# Altium schematic sheet CH32V307WCU6-R0.SchDoc
size 332 x 281 mm
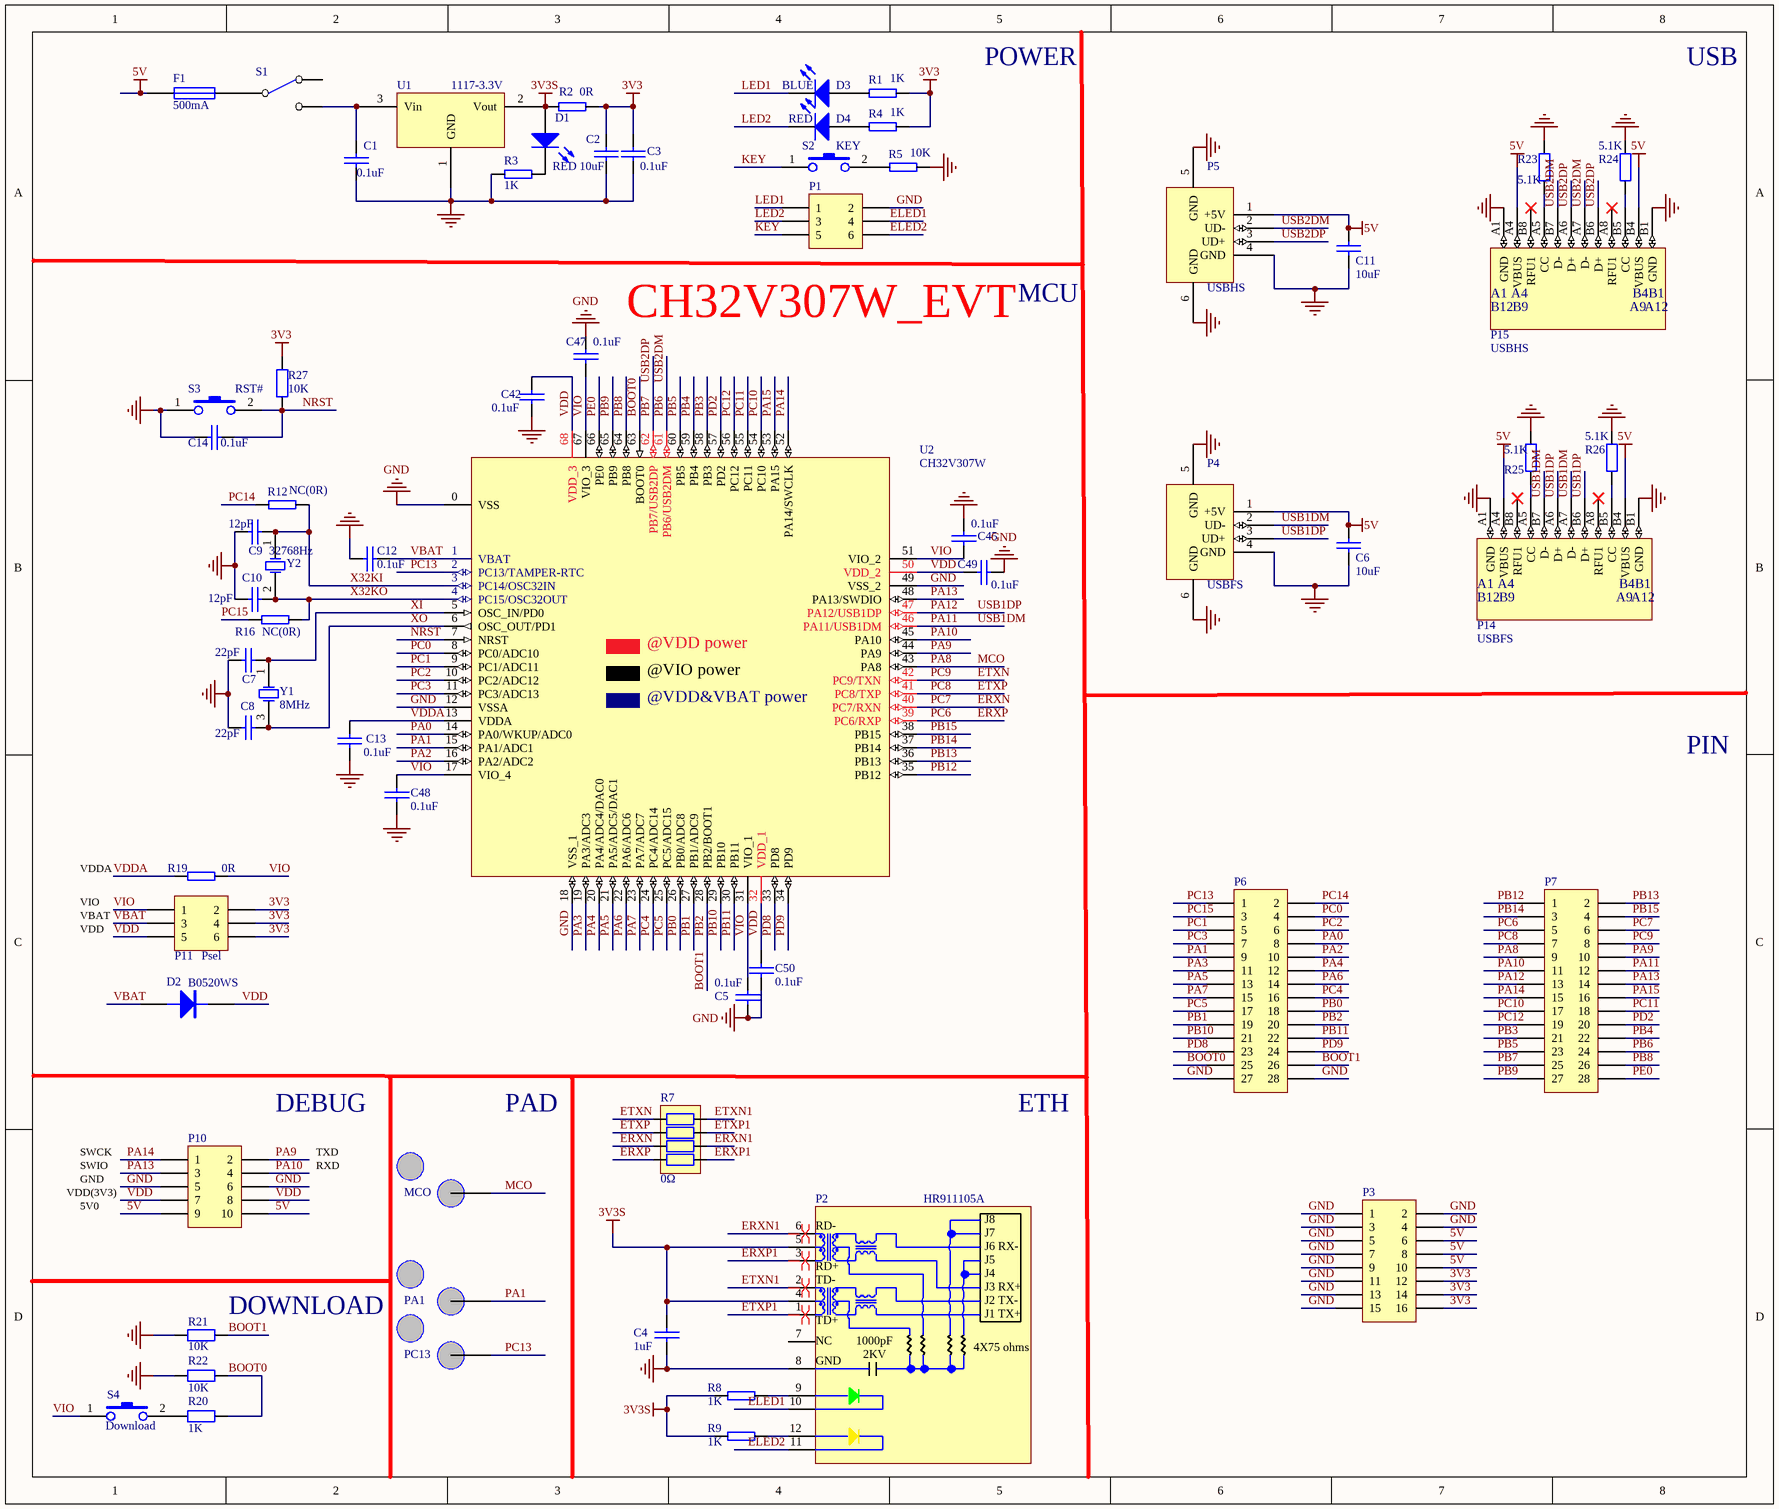
[diagram p0: CH32V307WCU6-R0.SchDoc]

## Parts
C1  0.1uF  [0603_C]
C2  10uF  [3216_C]
C3  0.1uF  [0603_C]
C4  1uF  [0603_C]
C5  0.1uF  [0603_C]
C6  10uF  [3216_C]
C7  22pF  [0603_C]
C8  22pF  [0603_C]
C9  12pF  [0603_C]
C10  12pF  [0603_C]
C11  10uF  [3216_C]
C12  0.1uF  [0603_C]
C13  0.1uF  [0603_C]
C14  0.1uF  [0603_C]
C42  0.1uF  [0603_C]
C45  0.1uF  [0603_C]
C47  0.1uF  [0603_C]
C48  0.1uF  [0603_C]
C49  0.1uF  [0603_C]
C50  0.1uF  [0603_C]
D1  RED  [0603+]
D2  B0520WS  [SOD-323]
D3  BLUE  [0603+]
D4  RED  [0603+]
F1  500mA  [0603]
MCO  Testpoint  [TESTPOINT1]  (value not drawn)
P1  IO  [IDC6-2.54mm]  (value not drawn)
P2  HR911105A  [HR911105A]
P3  Ppin  [IDC16-2.54mm]  (value not drawn)
P4  USBFS  [USBAF]
P5  USBHS  [USBAF]
P6  HEADER 14x2  [IDC28-2.54MM]  (value not drawn)
P7  HEADER 14x2  [IDC28-2.54MM]  (value not drawn)
P10  LINK  [IDC10-2.54mm]  (value not drawn)
P11  Psel  [IDC6-2.54mm]
P14  USBFS  [TYPE-C-Receptacle-2.0]
P15  USBHS  [TYPE-C-Receptacle-2.0]
PA1  Testpoint  [TESTPOINT1]  (value not drawn)
PC13  Testpoint  [TESTPOINT1]  (value not drawn)
R1  1K  [0603]
R2  0R  [0603]
R3  1K  [0603]
R4  1K  [0603]
R5  10K  [0603]
R7  0Ω  [8P4R-0603]
R8  1K  [0603]
R9  1K  [0603]
R12  NC(0R)  [0603]
R16  NC(0R)  [0603]
R19  0R  [0603]
R20  1K  [0603]
R21  10K  [0603]
R22  10K  [0603]
R23  5.1K  [0603]
R24  5.1K  [0603]
R25  5.1K  [0603]
R26  5.1K  [0603]
R27  10K  [0603]
S1  SW SPDT  [KEY2]  (value not drawn)
S2  KEY  [SMD_6.1x3.65x2.5mm-KEY]
S3  RST#  [SMD_6.1x3.65x2.5mm-KEY]
S4  Download  [SMD_6.1x3.65x2.5mm-KEY]
U1  1117-3.3V  [SOT-223]
U2  CH32V307W  [QFN68_8x8]
Y1  8MHz  [XT3225]
Y2  32768Hz  [FC-135]

## Nets
3V3: C2.1 C3.1 P3.12 P3.14 P3.16 P11.2 P11.4 P11.6 R1.1 R2.1 R4.1 R27.2
3V3S: C4.2 D1.1(A) P2.4 P2.5 R2.2 R8.1 R9.1 U1.2(Vout)
5V: C6.1 C11.1 F1.1 P3.6 P3.8 P3.10 P4.1(+5V) P5.1(+5V) P10.9 P10.10 P14.A4(VBUS) P14.B4(VBUS) P15.A4(VBUS) P15.B4(VBUS)
GND: C1.2 C2.2 C3.2 C4.1 C5.1 C6.2 C7.1 C8.1 C9.1 C10.1 C11.2 C12.1 C13.2 C14.1 C42.1 C45.2 C47.2 C48.2 C49.1 C50.2 P1.2 P2.8 P3.1 P3.2 P3.3 P3.4 P3.5 P3.7 P3.9 P3.11 P3.13 P3.15 P4.4(GND) P4.5(GND) P4.6(GND) P5.4(GND) P5.5(GND) P5.6(GND) P6.27 P6.28 P10.5 P10.6 P14.A1(GND) P14.B1(GND) P15.A1(GND) P15.B1(GND) R3.2 R5.1 R21.2 R22.2 R23.2 R24.2 R25.2 R26.2 S3.1 U1.1(GND) U2.0(VSS) U2.12(VSSA) U2.18(VSS_1) U2.49(VSS_2)
BOOT0: P6.25 R20.1 R22.1 U2.63(BOOT0)
BOOT1: P6.20 P6.26 R21.1 U2.28(PB2/BOOT1)  [also labelled PB2]
ELED1: P1.4 P2.10
ELED2: P1.6 P2.11
ERXN: P7.6 R7.3 U2.40(PC7/RXN)  [also labelled PC7]
ERXN1: P2.6 R7.6
ERXP: P7.5 R7.4 U2.39(PC6/RXP)  [also labelled PC6]
ERXP1: P2.3 R7.5
ETXN: P7.8 R7.1 U2.42(PC9/TXN)  [also labelled PC9]
ETXN1: P2.2 R7.8
ETXP: P7.7 R7.2 U2.41(PC8/TXP)  [also labelled PC8]
ETXP1: P2.1 R7.7
KEY: P1.5 S2.1
LED1: D3.2(K) P1.1
LED2: D4.2(K) P1.3
MCO: MCO.1(point) P7.9 U2.43(PA8)  [also labelled PA8]
NRST: C14.2 R27.1 S3.2 U2.7(NRST)
PA0: P6.8 U2.14(PA0/WKUP/ADC0)
PA1: P6.9 PA1.1(point) U2.15(PA1/ADC1)
PA2: P6.10 U2.16(PA2/ADC2)
PA3: P6.11 U2.19(PA3/ADC3)
PA4: P6.12 U2.20(PA4/ADC4/DAC0)
PA5: P6.13 U2.21(PA5/ADC5/DAC1)
PA6: P6.14 U2.22(PA6/ADC6)
PA7: P6.15 U2.23(PA7/ADC7)
PA9: P7.10 P10.2 U2.44(PA9)
PA10: P7.11 P10.4 U2.45(PA10)
PA11: P4.2(UD-) P7.12 P14.A7(D-) P14.B7(D-) U2.46(PA11/USB1DM)  [also labelled USB1DM]
PA12: P4.3(UD+) P7.13 P14.A6(D+) P14.B6(D+) U2.47(PA12/USB1DP)  [also labelled USB1DP]
PA13: P7.14 P10.3 U2.48(PA13/SWDIO)
PA14: P7.15 P10.1 U2.52(PA14/SWCLK)
PA15: P7.16 U2.53(PA15)
PB0: P6.18 U2.26(PB0/ADC8)
PB1: P6.19 U2.27(PB1/ADC9)
PB3: P7.21 U2.58(PB3)
PB4: P7.22 U2.59(PB4)
PB5: P7.23 U2.60(PB5)
PB6: P5.2(UD-) P7.24 P15.A7(D-) P15.B7(D-) U2.61(PB6/USB2DM)  [also labelled USB2DM]
PB7: P5.3(UD+) P7.25 P15.A6(D+) P15.B6(D+) U2.62(PB7/USB2DP)  [also labelled USB2DP]
PB8: P7.26 U2.64(PB8)
PB9: P7.27 U2.65(PB9)
PB10: P6.21 U2.29(PB10)
PB11: P6.22 U2.30(PB11)
PB12: P7.1 U2.35(PB12)
PB13: P7.2 U2.36(PB13)
PB14: P7.3 U2.37(PB14)
PB15: P7.4 U2.38(PB15)
PC0: P6.4 U2.8(PC0/ADC10)
PC1: P6.5 U2.9(PC1/ADC11)
PC2: P6.6 U2.10(PC2/ADC12)
PC3: P6.7 U2.11(PC3/ADC13)
PC4: P6.16 U2.24(PC4/ADC14)
PC5: P6.17 U2.25(PC5/ADC15)
PC10: P7.17 U2.54(PC10)
PC11: P7.18 U2.55(PC11)
PC12: P7.19 U2.56(PC12)
PC13: P6.1 PC13.1(point) U2.2(PC13/TAMPER-RTC)
PC14: P6.2 R12.1
PC15: P6.3 R16.1
PD2: P7.20 U2.57(PD2)
PD8: P6.23 U2.33(PD8)
PD9: P6.24 U2.34(PD9)
PE0: P7.28 U2.66(PE0)
VBAT: C12.2 D2.1(A) P11.3 U2.1(VBAT)
VDD: C42.2 C49.2 C50.1 D2.2(K) P10.7 P10.8 P11.5 U2.32(VDD_1) U2.50(VDD_2) U2.68(VDD_3)
VDDA: C13.1 R19.2 U2.13(VDDA)
VIO: C5.2 C45.1 C47.1 C48.1 P11.1 R19.1 S4.1 U2.17(VIO_4) U2.31(VIO_1) U2.51(VIO_2) U2.67(VIO_3)
X32KI: C9.2 R12.2 U2.3(PC14/OSC32IN) Y2.1(OSC1)
X32KO: C10.2 R16.2 U2.4(PC15/OSC32OUT) Y2.2(OSC2)
XI: C7.2 U2.5(OSC_IN/PD0) Y1.1(OSC1)
XO: C8.2 U2.6(OSC_OUT/PD1) Y1.3(OSC2)
NetC1_1: C1.1 S1.2(NC) U1.3(Vin)
NetD1_2: D1.2(K) R3.1
NetD3_1: D3.1(A) R1.2
NetD4_1: D4.1(A) R4.2
NetF1_2: F1.2 S1.1(COMMON)
NetP2_9: P2.9 R8.2
NetP2_12: P2.12 R9.2
NetP14_A5: P14.A5(CC) R25.1
NetP14_B5: P14.B5(CC) R26.1
NetP15_A5: P15.A5(CC) R23.1
NetP15_B5: P15.B5(CC) R24.1
NetR5_2: R5.2 S2.2
NetR20_2: R20.2 S4.2

Not connected (* = marked no-connect by the designer): P2 7; P14 A8(RFU1)* B8(RFU1)*; P15 A8(RFU1)* B8(RFU1)*; S1 3(NO)

## Layout directives
differential pair: ERXN1, ERXP1, ETXN1, ETXP1

## Notes on the sheet
- POWER
- USB
- MCU
- CH32V307W_EVT
- PIN
- VDDA
- VIO
- VBAT
- VDD
- (near P10) DEBUG
- PAD
- ETH
- SWCK
- SWIO
- GND
- TXD
- RXD
- VDD(3V3)
- 5V0
- (near R21) DOWNLOAD
- (in symbol CH32V307W) @VDD power; @VIO power; @VDD&VBAT power
- (in symbol HR911105A) J8; RD-; J7; J6; RX-; J5; RD+; J4; TD-; J3; RX+; J2; TX-; J1; TX+; TD+; NC; 1000pF; 4X75 ohms; 2KV; GND
- (in symbol TYPE-C1) B12; B9; A9; A12

## Library data of the parts
C1-C14 C42 C45 C47-C50 = CAP: Capacitor
D1 D3 D4 = LED0: Typical INFRARED GaAs LED; Published: 8-Jun-2000; LatestRevisionDate: 08-Jul-2005; LatestRevisionNote: Mech Layer 1 removed.; PackageReference: LED-0; Publisher: Altium Limited; PackageDescription: LED; 2 Leads
D2 = DIODE
F1 = FUSE1: Fuse
MCO PA1 PC13 = Testpoint: 测试点
P1 P11 = Header 3X2H: Header, 3-Pin, Dual row, Right Angle; LatestRevisionDate: 17-Jul-2002; LatestRevisionNote: Re-released for DXP Platform.; Publisher: Altium Limited
P3 = Header 8X2H: Header, 8-Pin, Dual row, Right Angle; LatestRevisionDate: 17-Jul-2002; LatestRevisionNote: Re-released for DXP Platform.; Publisher: Altium Limited
P4 P5 = USB: USB Port
P6 P7 = HEADER 14x2: Header, 14-Pin, Dual row
P10 = Header 5X2H: Header, 5-Pin, Dual row, Right Angle; LatestRevisionDate: 17-Jul-2002; LatestRevisionNote: Re-released for DXP Platform.; Publisher: Altium Limited
P14 P15 = TYPE-C1
R1-R5 R8 R9 R12 R16 = RES
R7 = R-8P4R: 贴片网络排阻; 版权归属: 源创客; BOM名称: 贴片网络排阻; 学习资源: www.ooocke.com
R19 = R
R20-R27 = Res2: Resistor
  R20: Published: 8-Jun-2000; LatestRevisionDate: 17-Jul-2002; LatestRevisionNote: Re-released for DXP Platform.; PackageReference: AXIAL-0.4; Publisher: Altium Limited
  R21 R22 R27: Published: 8-Jun-2000; LatestRevisionDate: 17-Jul-2002; LatestRevisionNote: Re-released for DXP Platform.; PackageReference: AXIAL-0.4; Publisher: Altium Limited; Value: 10K
S2-S4 = KEY1
U2 = CH32V307W: RISC-V FPU HD-MCU, 144MHz, USB_480M, USB OTG, 1000M Ethernet MAC, 2*CAN
Y1 Y2 = XTAL: Crystal Oscillator; Published: 8-Jun-2000; LatestRevisionDate: 17-Jul-2002; LatestRevisionNote: Re-released for DXP Platform.; PackageReference: R38; Publisher: Altium Limited; PackageDescription: Crystal, Thru-Hole; 2 Leads; Body 3.1 x 8.2 mm (Dia.xH)